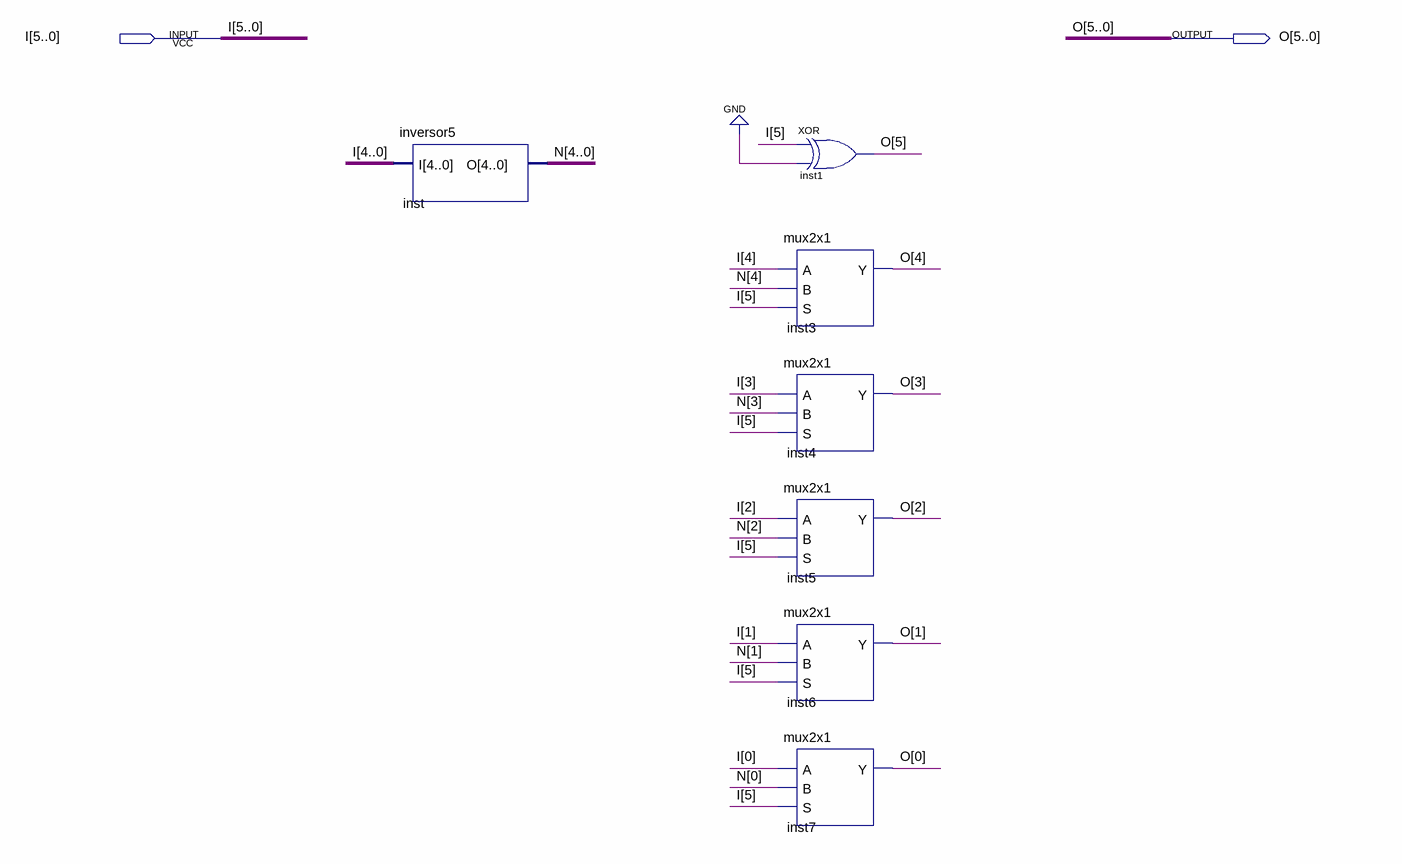
[diagram p0: schematic sheet]
// Quartus schematic c2_para_sm.bdf as structural Verilog: 7 symbols, 2 pins
module c2_para_sm (
  input  [5:0] I,
  output [5:0] O
);

  wire [4:0] N;

  inversor5 inst (.I(I[4:0]), .O(N));
  mux2x1 inst3 (.A(I[4]), .B(N[4]), .S(I[5]), .Y(O[4]));
  mux2x1 inst4 (.A(I[3]), .B(N[3]), .S(I[5]), .Y(O[3]));
  mux2x1 inst5 (.A(I[2]), .B(N[2]), .S(I[5]), .Y(O[2]));
  mux2x1 inst6 (.A(I[1]), .B(N[1]), .S(I[5]), .Y(O[1]));
  mux2x1 inst7 (.A(I[0]), .B(N[0]), .S(I[5]), .Y(O[0]));
  xor inst1 (O[5], I[5], 1'b0);
endmodule
